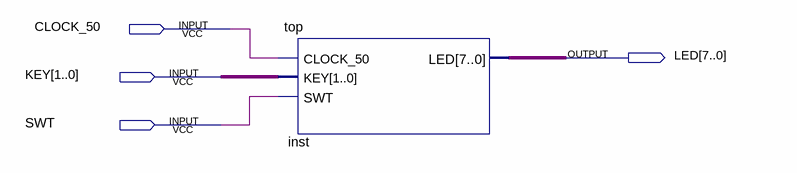
[diagram p0: schematic sheet]
// Quartus schematic fpga_gateway.bdf as structural Verilog: 1 symbols, 4 pins
module fpga_gateway (
  input  CLOCK_50,
  input  [1:0] KEY,
  input  SWT,
  output [7:0] LED
);

  top inst (.CLOCK_50(CLOCK_50), .KEY(KEY), .SWT(SWT), .LED(LED));
endmodule
